# Altium schematic sheet Ethernet_LAN8742A_simple.SchDoc
size A4
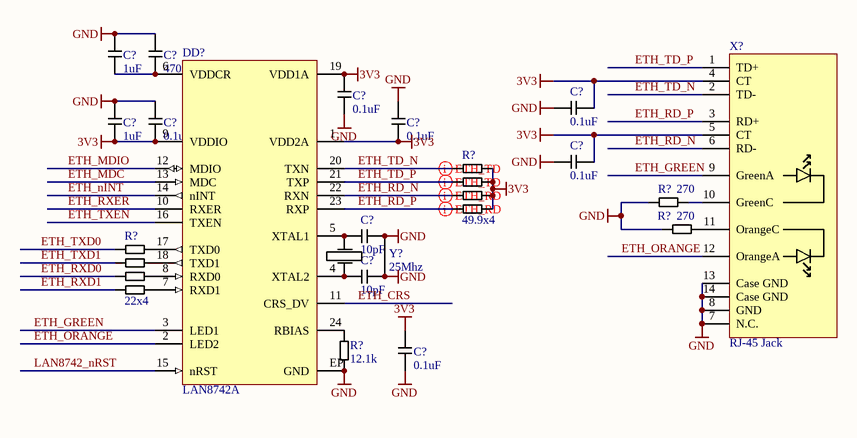
[diagram p0: Ethernet_LAN8742A_simple.SchDoc]

## Parts
(Parts that share a designator on the sheet are numbered #1, #2 ... from top to bottom, then left to right.)
C?#1  1uF  [C0603]
C?#2  470pF  [C0603]
C?#3  0.1uF  [C0603]
C?#4  0.1uF  [C0603]
C?#5  1uF  [C0603]
C?#6  0.1uF  [C0603]
C?#7  0.1uF  [C0603]
C?#8  0.1uF  [C0603]
C?#9  10pF  [C0603]
C?#10  10pF  [C0603]
C?#11  0.1uF  [C0603]
DD?  LAN8742A  [QFN-24]
R?#1  49.9x4  [R0508-4]
R?#2  270  [R0603]
R?#3  270  [R0603]
R?#4  22x4  [R0508-4]
R?#5  12.1k  [R0603]
X?  RJ-45 Jack  [J011D21BNL]
Y?  25Mhz  [XTAL 2532]

## Nets
3V3: C?#3.1 C?#4.2 C?#5.2 C?#6.2 C?#7.2 C?#8.2 C?#11.2 DD?.1(VDD2A) DD?.9(VDDIO) DD?.19(VDD1A) R?#1.5 R?#1.6 R?#1.7 R?#1.8 X?.4(CT) X?.5(CT)
GND: C?#1.1 C?#2.1 C?#3.2 C?#4.1 C?#5.1 C?#6.1 C?#7.1 C?#8.1 C?#9.2 C?#10.2 C?#11.1 DD?.EP(GND) R?#2.1 R?#3.1 R?#5.1 X?.7(N.C.) X?.8(GND) X?.13(Case_GND) X?.14(Case_GND) Y?.1(GND) Y?.3(GND)
ETH_CRS: DD?.11(CRS_DV)
ETH_GREEN: DD?.3(LED1) X?.9(GreenA)
ETH_MDC: DD?.13(MDC)
ETH_MDIO: DD?.12(MDIO)
ETH_nINT: DD?.14(nINT)
ETH_ORANGE: DD?.2(LED2) X?.12(OrangeA)
ETH_RD_N: DD?.22(RXN) R?#1.2 X?.6(RD-)
ETH_RD_P: DD?.23(RXP) R?#1.1 X?.3(RD+)
ETH_RXD0: R?#4.2
ETH_RXD1: R?#4.1
ETH_RXER: DD?.10(RXER)
ETH_TD_N: DD?.20(TXN) R?#1.4 X?.2(TD-)
ETH_TD_P: DD?.21(TXP) R?#1.3 X?.1(TD+)
ETH_TXD0: R?#4.4
ETH_TXD1: R?#4.3
ETH_TXEN: DD?.16(TXEN)
LAN8742_nRST: DD?.15(nRST)
NetC?#1_2: C?#1.2 C?#2.2 DD?.6(VDDCR)
NetC?#9_1: C?#9.1 DD?.5(XTAL1) Y?.4(X2)
NetC?#10_1: C?#10.1 DD?.4(XTAL2) Y?.2(X1)
NetDD?_7: DD?.7(RXD1) R?#4.8
NetDD?_8: DD?.8(RXD0) R?#4.7
NetDD?_17: DD?.17(TXD0) R?#4.5
NetDD?_18: DD?.18(TXD1) R?#4.6
NetDD?_24: DD?.24(RBIAS) R?#5.2
NetR?#2_2: R?#2.2 X?.10(GreenC)
NetR?#3_2: R?#3.2 X?.11(OrangeC)

## Layout directives
differential pair: ETH_RD_N, ETH_RD_P, ETH_TD_N, ETH_TD_P

## Library data of the parts
C?#1-C?#11 = C: Capacitor
DD? = LAN8742A: Ethernet PHY
R?#1 R?#4 = Rx4: Resistors array
R?#2 R?#3 R?#5 = R: Resistor
X? = RJ-45 Jack: Ethernet jack
Y? = Xtal: Quartz crystal